# Altium project 16-07349-R5_SAM_L10_XPro.PrjPcb (part 1 of 3)
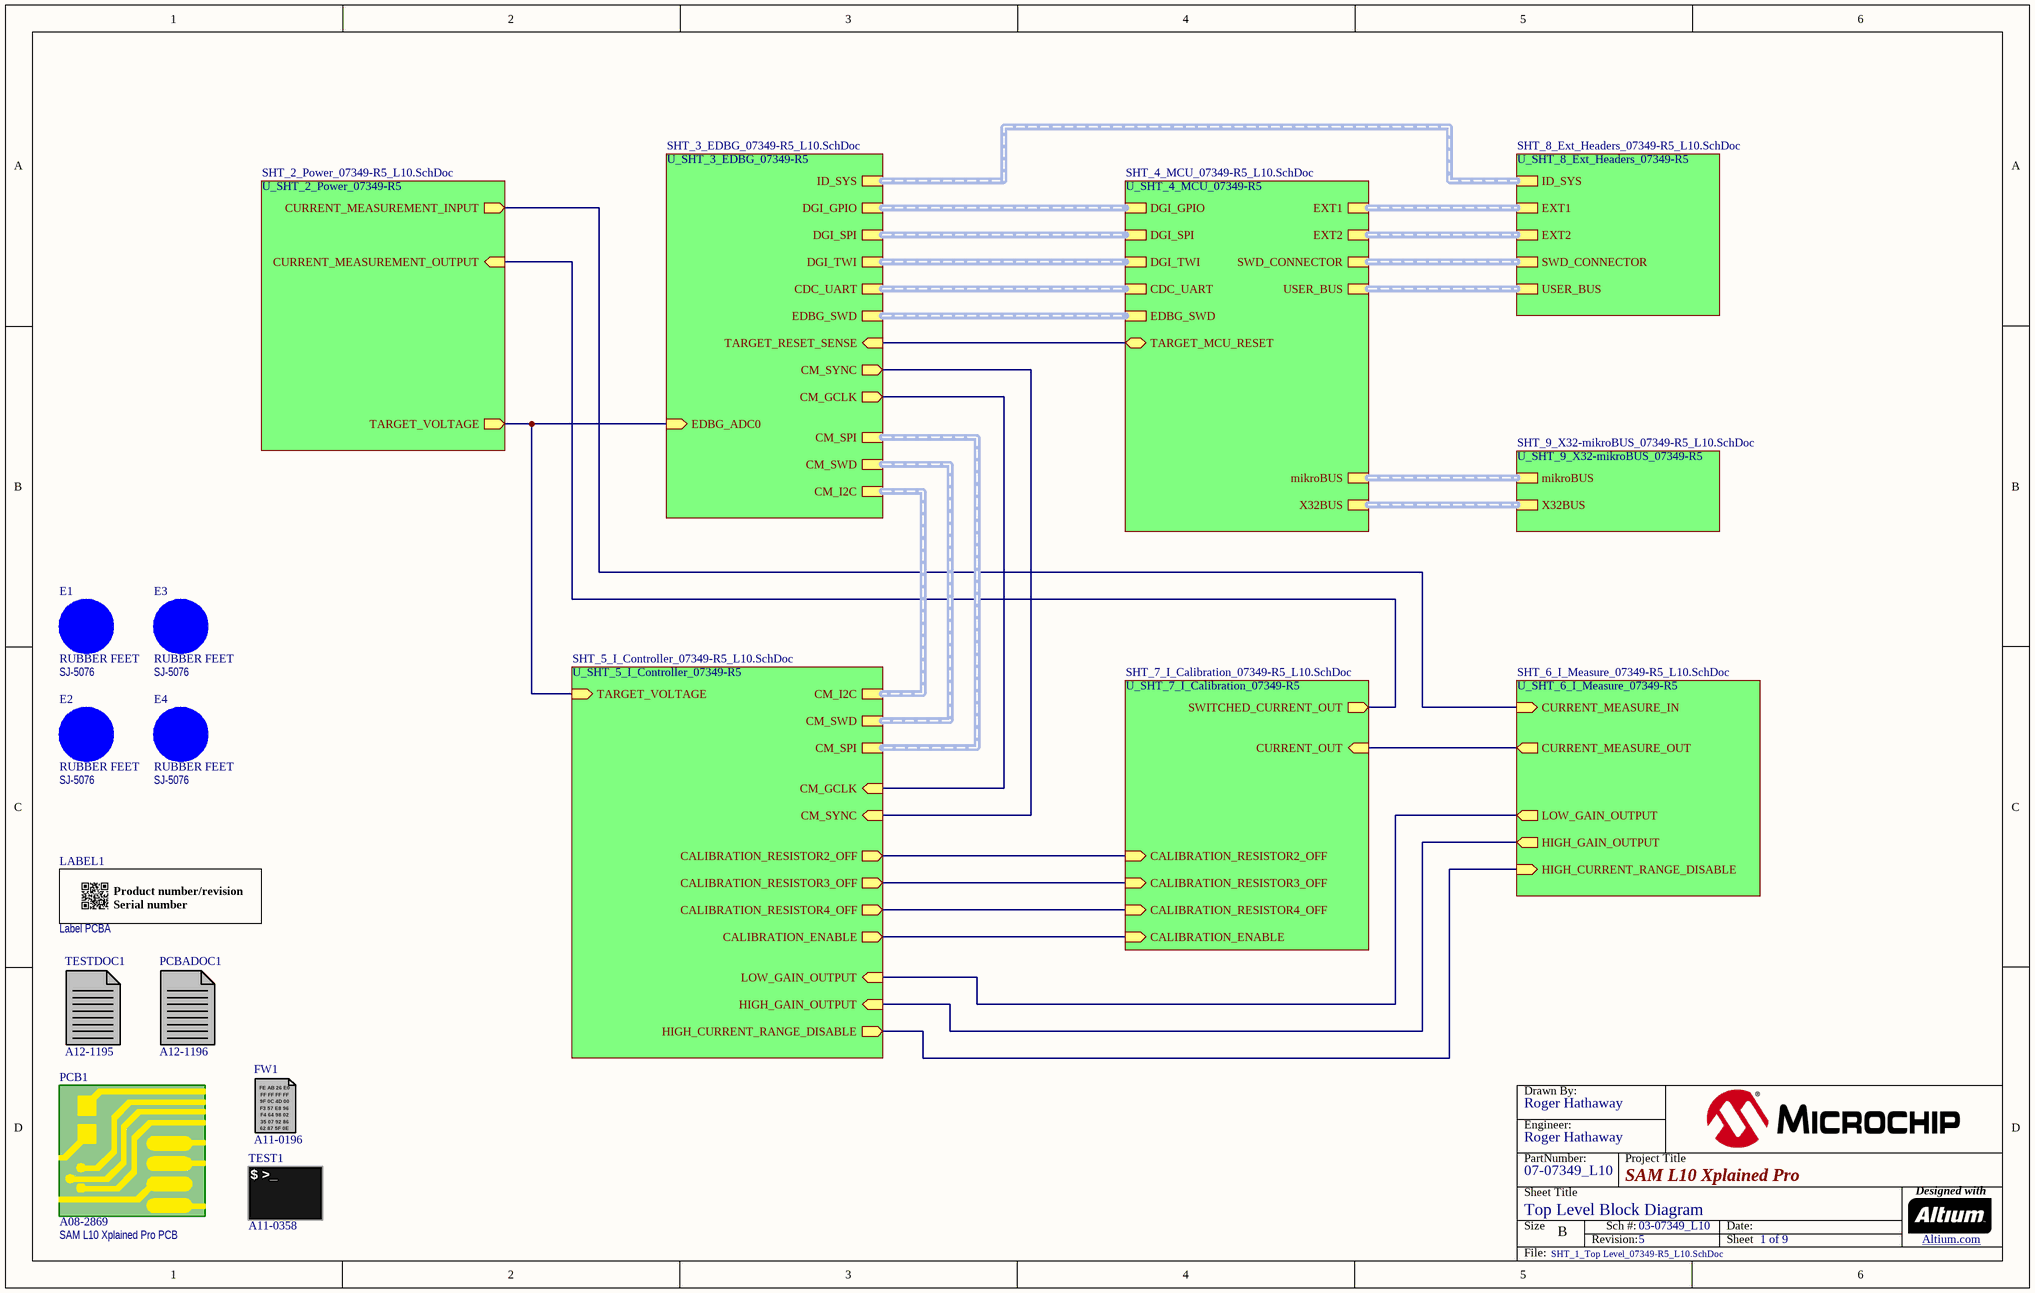
[diagram p0: SHT_1_Top Level_07349-R5_L10.SchDoc]
ProjectBoardNumber: 07349_L10; ProjectDrawnBy: Roger Hathaway; ProjectEngineer: Roger Hathaway; ProjectPartNumber: 07-07349_L10; ProjectRevisionART: 5; ProjectRevisionASSY: 5; ProjectRevisionFAB: 5; ProjectRevisionSCH: 5; ProjectTitle: SAM L10 Xplained Pro
9 sheets, 240 parts. Net scope: hierarchical (ports join the sheet entries above them; power ports are global).
Board file: 04-07349-R5_L10.PcbDoc
Sheets:
  SHT_1_Top Level_07349-R5_L10.SchDoc
    U_SHT_7_I_Calibration_07349-R5 = SHT_7_I_Calibration_07349-R5_L10.SchDoc
    U_SHT_6_I_Measure_07349-R5 = SHT_6_I_Measure_07349-R5_L10.SchDoc
    U_SHT_9_X32-mikroBUS_07349-R5 = SHT_9_X32-mikroBUS_07349-R5_L10.SchDoc
    U_SHT_8_Ext_Headers_07349-R5 = SHT_8_Ext_Headers_07349-R5_L10.SchDoc
    U_SHT_4_MCU_07349-R5 = SHT_4_MCU_07349-R5_L10.SchDoc
    U_SHT_3_EDBG_07349-R5 = SHT_3_EDBG_07349-R5_L10.SchDoc
    U_SHT_2_Power_07349-R5 = SHT_2_Power_07349-R5_L10.SchDoc
    U_SHT_5_I_Controller_07349-R5 = SHT_5_I_Controller_07349-R5_L10.SchDoc

## Sheet SHT_1_Top Level_07349-R5_L10.SchDoc
size B; CompanyName: Microchip Technology Inc.; Organization: Microchip Technology; Address1: 2355 West Chandler Blvd.; Address2: Chandler, AZ  85224; Address4: USA; SheetNumber: 1; SheetTotal: 9; SheetTitle: Top Level Block Diagram; Time: Time

### Parts
(Parts that share a designator on the sheet are numbered #1, #2 ... from top to bottom, then left to right.)
?#1  (no value)  (graphical)
E1  RUBBER FEET  value SJ-5076  [AP8-00192]
E2  RUBBER FEET  value SJ-5076  [AP8-00192]
E3  RUBBER FEET  value SJ-5076  [AP8-00192]
E4  RUBBER FEET  value SJ-5076  [AP8-00192]
FW1  AN: A11-0196  (hidden comment: FW)  (mechanical)
LABEL1  value Label PCBA  [AP8-00317]  (hidden comment: PCBA_LABEL)
PCB1  value SAM L10 Xplained Pro PCB  AN: A08-2869  (hidden comment: PCB)  (mechanical)
PCBADOC1  AN: A12-1196  (hidden comment: PCBADOC)  (mechanical)
TEST1  AN: A11-0358  (hidden comment: TEST)  (mechanical)
TESTDOC1  AN: A12-1195  (hidden comment: TESTDOC)  (mechanical)

### Sub-sheets
U_SHT_2_Power_07349-R5 = SHT_2_Power_07349-R5_L10.SchDoc: TARGET_VOLTAGE (out), CURRENT_MEASUREMENT_INPUT (out), CURRENT_MEASUREMENT_OUTPUT (in)
U_SHT_3_EDBG_07349-R5 = SHT_3_EDBG_07349-R5_L10.SchDoc: CDC_UART (harness CDC_UART), DGI_TWI (harness DGI_TWI), DGI_SPI (harness DGI_SPI), DGI_GPIO (harness DGI_GPIO), ID_SYS (harness ID_SYS), EDBG_ADC0 (in), CM_I2C (harness CM_I2C), CM_GCLK (out), CM_SYNC (out), CM_SWD (harness CM_SWD), CM_SPI (harness CM_SPI), EDBG_SWD (harness EDBG_SWD), TARGET_RESET_SENSE (in)
U_SHT_4_MCU_07349-R5 = SHT_4_MCU_07349-R5_L10.SchDoc: DGI_GPIO (harness DGI_GPIO), DGI_SPI (harness DGI_SPI), DGI_TWI (harness DGI_TWI), CDC_UART (harness CDC_UART), EXT2 (harness EXT), EXT1 (harness EXT), SWD_CONNECTOR (harness SWD), TARGET_MCU_RESET (bidir), EDBG_SWD (harness EDBG_SWD), mikroBUS (harness mikroBUS), X32BUS (harness X32BUS), USER_BUS (harness USER_BUS)
U_SHT_5_I_Controller_07349-R5 = SHT_5_I_Controller_07349-R5_L10.SchDoc: LOW_GAIN_OUTPUT (in), HIGH_GAIN_OUTPUT (in), HIGH_CURRENT_RANGE_DISABLE (out), CM_SPI (harness CM_SPI), CALIBRATION_RESISTOR4_OFF (out), CALIBRATION_RESISTOR2_OFF (out), CALIBRATION_RESISTOR3_OFF (out), CALIBRATION_ENABLE (out), CM_I2C (harness CM_I2C), CM_GCLK (in), CM_SYNC (in), TARGET_VOLTAGE (in), CM_SWD (harness CM_SWD)
U_SHT_6_I_Measure_07349-R5 = SHT_6_I_Measure_07349-R5_L10.SchDoc: LOW_GAIN_OUTPUT (out), HIGH_GAIN_OUTPUT (out), HIGH_CURRENT_RANGE_DISABLE (in), CURRENT_MEASURE_OUT (out), CURRENT_MEASURE_IN (in)
U_SHT_7_I_Calibration_07349-R5 = SHT_7_I_Calibration_07349-R5_L10.SchDoc: CALIBRATION_RESISTOR3_OFF (in), CALIBRATION_RESISTOR4_OFF (in), CALIBRATION_RESISTOR2_OFF (in), SWITCHED_CURRENT_OUT (out), CURRENT_OUT (in), CALIBRATION_ENABLE (in)
U_SHT_8_Ext_Headers_07349-R5 = SHT_8_Ext_Headers_07349-R5_L10.SchDoc: ID_SYS (harness ID_SYS), EXT1 (harness EXT), EXT2 (harness EXT), SWD_CONNECTOR (harness SWD), USER_BUS (harness USER_BUS)
U_SHT_9_X32-mikroBUS_07349-R5 = SHT_9_X32-mikroBUS_07349-R5_L10.SchDoc: mikroBUS (harness mikroBUS), X32BUS (harness X32BUS)

### Nets
CM_PA00_GPIO: sheet U_SHT_7_I_Calibration_07349-R5/CALIBRATION_RESISTOR3_OFF, sheet U_SHT_5_I_Controller_07349-R5/CALIBRATION_RESISTOR3_OFF
CM_PA01_GPIO: sheet U_SHT_7_I_Calibration_07349-R5/CALIBRATION_RESISTOR4_OFF, sheet U_SHT_5_I_Controller_07349-R5/CALIBRATION_RESISTOR4_OFF
CM_PA05_AIN5: sheet U_SHT_6_I_Measure_07349-R5/LOW_GAIN_OUTPUT, sheet U_SHT_5_I_Controller_07349-R5/LOW_GAIN_OUTPUT
CM_PA08_AIN16: sheet U_SHT_6_I_Measure_07349-R5/HIGH_GAIN_OUTPUT, sheet U_SHT_5_I_Controller_07349-R5/HIGH_GAIN_OUTPUT
CM_PA09_AIN17: sheet U_SHT_3_EDBG_07349-R5/EDBG_ADC0, sheet U_SHT_2_Power_07349-R5/TARGET_VOLTAGE, sheet U_SHT_5_I_Controller_07349-R5/TARGET_VOLTAGE
CM_PA10_GPIO: sheet U_SHT_7_I_Calibration_07349-R5/CALIBRATION_ENABLE, sheet U_SHT_5_I_Controller_07349-R5/CALIBRATION_ENABLE
CM_PA11_GCLK5: sheet U_SHT_3_EDBG_07349-R5/CM_SYNC, sheet U_SHT_5_I_Controller_07349-R5/CM_SYNC
CM_PA14_GCLK0: sheet U_SHT_3_EDBG_07349-R5/CM_GCLK, sheet U_SHT_5_I_Controller_07349-R5/CM_GCLK
CM_PA15_GPIO: sheet U_SHT_7_I_Calibration_07349-R5/CALIBRATION_RESISTOR2_OFF, sheet U_SHT_5_I_Controller_07349-R5/CALIBRATION_RESISTOR2_OFF
CM_PA18_CMP0: sheet U_SHT_6_I_Measure_07349-R5/HIGH_CURRENT_RANGE_DISABLE, sheet U_SHT_5_I_Controller_07349-R5/HIGH_CURRENT_RANGE_DISABLE
CURRENT_MEASURE_OUT: sheet U_SHT_7_I_Calibration_07349-R5/CURRENT_OUT, sheet U_SHT_6_I_Measure_07349-R5/CURRENT_MEASURE_OUT
CURRENT_MEASUREMENT_OUTPUT: sheet U_SHT_7_I_Calibration_07349-R5/SWITCHED_CURRENT_OUT, sheet U_SHT_2_Power_07349-R5/CURRENT_MEASUREMENT_OUTPUT
TARGET_MCU_RESET: sheet U_SHT_4_MCU_07349-R5/TARGET_MCU_RESET, sheet U_SHT_3_EDBG_07349-R5/TARGET_RESET_SENSE
VCC_CM_IN_P3V3: sheet U_SHT_6_I_Measure_07349-R5/CURRENT_MEASURE_IN, sheet U_SHT_2_Power_07349-R5/CURRENT_MEASUREMENT_INPUT

Not connected (* = marked no-connect by the designer): E1 1(FIDUCIAL); E2 1(FIDUCIAL); E3 1(FIDUCIAL); E4 1(FIDUCIAL)

### Buses and harness runs
harness sheet U_SHT_3_EDBG_07349-R5/CDC_UART = sheet U_SHT_4_MCU_07349-R5/CDC_UART
harness sheet U_SHT_3_EDBG_07349-R5/CM_I2C = sheet U_SHT_5_I_Controller_07349-R5/CM_I2C
harness sheet U_SHT_3_EDBG_07349-R5/CM_SPI = sheet U_SHT_5_I_Controller_07349-R5/CM_SPI
harness sheet U_SHT_3_EDBG_07349-R5/CM_SWD = sheet U_SHT_5_I_Controller_07349-R5/CM_SWD
harness sheet U_SHT_3_EDBG_07349-R5/DGI_GPIO = sheet U_SHT_4_MCU_07349-R5/DGI_GPIO
harness sheet U_SHT_3_EDBG_07349-R5/DGI_SPI = sheet U_SHT_4_MCU_07349-R5/DGI_SPI
harness sheet U_SHT_3_EDBG_07349-R5/DGI_TWI = sheet U_SHT_4_MCU_07349-R5/DGI_TWI
harness sheet U_SHT_3_EDBG_07349-R5/EDBG_SWD = sheet U_SHT_4_MCU_07349-R5/EDBG_SWD
harness sheet U_SHT_3_EDBG_07349-R5/ID_SYS = sheet U_SHT_8_Ext_Headers_07349-R5/ID_SYS
harness sheet U_SHT_4_MCU_07349-R5/EXT1 = sheet U_SHT_8_Ext_Headers_07349-R5/EXT1
harness sheet U_SHT_4_MCU_07349-R5/EXT2 = sheet U_SHT_8_Ext_Headers_07349-R5/EXT2
harness sheet U_SHT_4_MCU_07349-R5/mikroBUS = sheet U_SHT_9_X32-mikroBUS_07349-R5/mikroBUS
harness sheet U_SHT_4_MCU_07349-R5/SWD_CONNECTOR = sheet U_SHT_8_Ext_Headers_07349-R5/SWD_CONNECTOR
harness sheet U_SHT_4_MCU_07349-R5/USER_BUS = sheet U_SHT_8_Ext_Headers_07349-R5/USER_BUS
harness sheet U_SHT_4_MCU_07349-R5/X32BUS = sheet U_SHT_9_X32-mikroBUS_07349-R5/X32BUS

### Notes on the sheet
- Drawn By:
- Engineer:
- PartNumber:
- Project Title
- Sheet Title
- Size
- B
- Revision:
- Sch #:
- Date:
- Sheet
- Designed with
- Altium.com <http://go.altium.com/MicrochipLandingPage_Evaluation.html>
- File:
- (in symbol A09-0611) / Product number/revision / Serial number
- (in symbol A11-0196) FE AB 26 E0; FF FF FF FF; 9F 0C 4D 00; F3 57 E8 96; F4 64 98 02; 35 07 92 86; 62 87 5F 0E
- (in symbol A11-0358) $ >_

### Library data of the parts
?#1 = Title Block B
E1-E4 = A08-0053: 2.8mm adhesive feet,diam 8.0mm; PartGroup: Mechanical devices,Mounting accessories; Manufacturer: 3M; ComponentStatus: 'Active (verified)'; Verified date: 2006-05-05; Verified by: Ketil Skjerve; Status: Active; AN: A08-0053; Height: 2.79999995231628; MPN: SJ-5076; FootprintStatus: 'Active (Verified)'
FW1 = A11-0196: EDBG secured firmware; PartGroup: Software,Firmware,Tools; Manufacturer: ATMEL; ComponentStatus: 'Active (verified)'; Value: EDBG secured firmware
LABEL1 = A09-0611: PCBA identification label PP Top White Gloss; PartGroup: Mechanical devices,Packaging materials,Printed Labels; Manufacturer: ACT Logimark AS; MPN: 505462; ComponentStatus: 'Active (verified)'; Status: New; AN: A09-0611; FootprintStatus: 'Active (Verified)'
PCB1 = A08-2869: SAM L10 Xplained Pro PCB, 4 layer, 60mm x 100mm; PartGroup: Mechanical devices,Printed circuit boards; ComponentStatus: 'Active (verified)'
PCBADOC1 = A12-1196: SAM L10 Xplained Pro PCBA documentation; PartGroup: Documentation,PCBA Documents,Atmel; Value: A09-2769 PCBA Files; ComponentStatus: 'Active (verified)'
TEST1 = A11-0358: Fixture test for SAM L10 Xplained Pro; PartGroup: Software,Test software,Starter Kit; Value: SAM L10 Xplained Pro test; ComponentStatus: 'Active (verified)'
TESTDOC1 = A12-1195: SAM L10 Xplained Pro Test Instructions; PartGroup: Documentation,Procedures,Test Instructions; ComponentStatus: 'Active (verified)'; Value: SAM L10 Xplained Pro Test Instructions

## Sheet SHT_7_I_Calibration_07349-R5_L10.SchDoc
size B; CompanyName: Microchip Technology Inc.; Organization: Microchip Technology; Address1: 2355 West Chandler Blvd.; Address2: Chandler, AZ  85224; Address4: USA; SheetNumber: 6; SheetTotal: 9; SheetTitle: Current Measurement Calibration; Time: Time
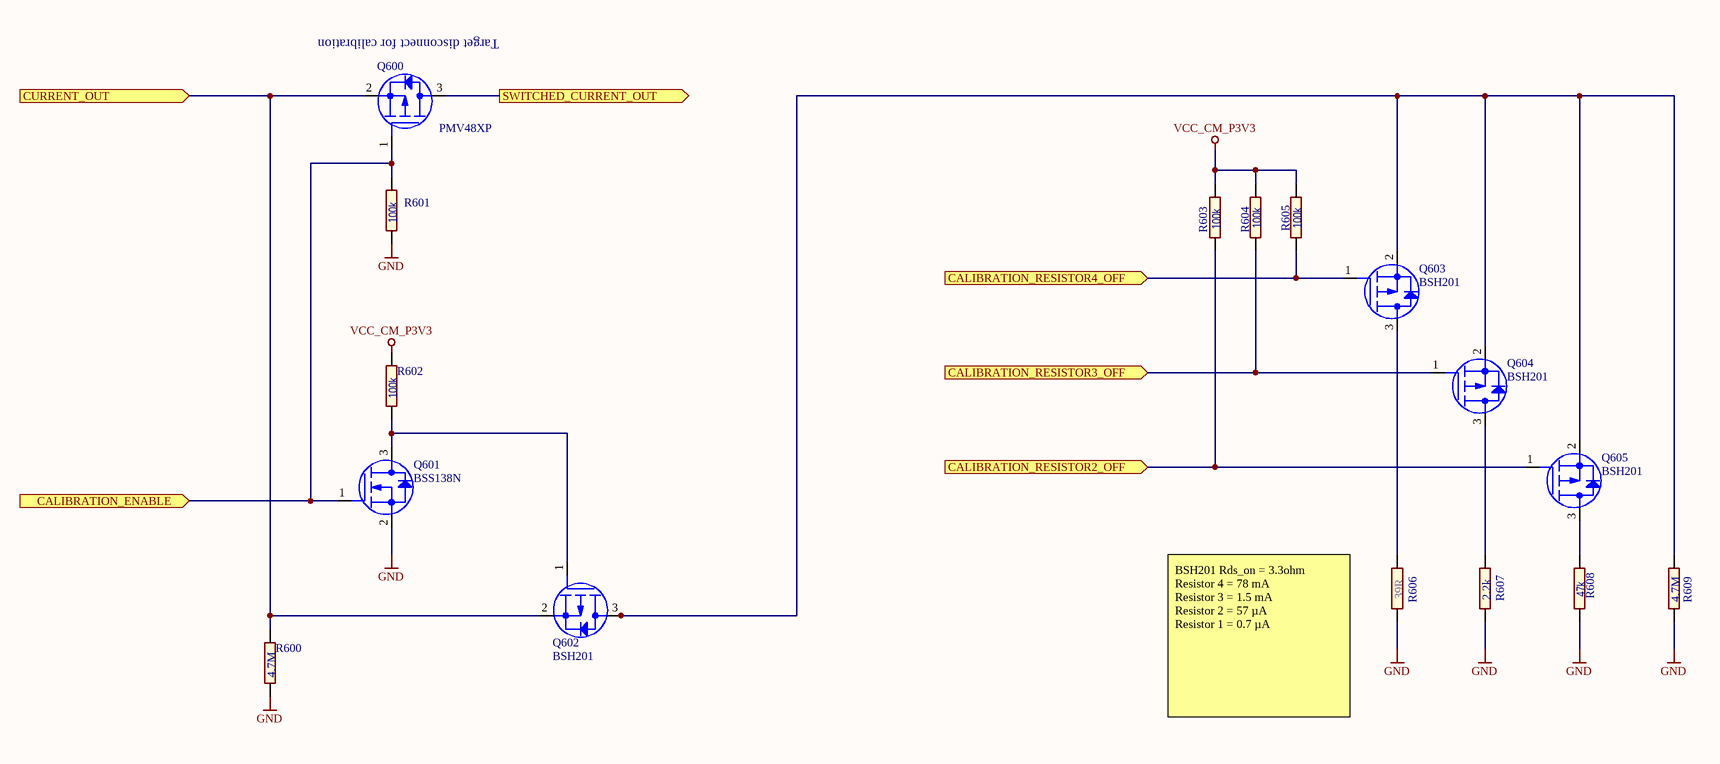
[diagram p1: SHT_7_I_Calibration_07349-R5_L10.SchDoc]

### Parts
(Parts that share a designator on the sheet are numbered #1, #2 ... from top to bottom, then left to right.)
?#2  (no value)  (graphical)
Q600  value PMV48XP  [AP5-00002]
Q601  value BSS138N  [AP5-00002]
Q602  value BSH201  [AP5-00002]
Q603  value BSH201  [AP5-00002]
Q604  value BSH201  [AP5-00002]
Q605  value BSH201  [AP5-00002]
R600  value 4.7M  [AP2-00011]
R601  value 100k  [AP2-00011]
R602  value 100k  [AP2-00011]
R603  value 100k  [AP2-00011]
R604  value 100k  [AP2-00011]
R605  value 100k  [AP2-00011]
R606  value 39R  [AP2-00011]
R607  value 2.2k  [AP2-00011]
R608  value 47k  [AP2-00011]
R609  value 4.7M  [AP2-00011]

### Ports
CALIBRATION_ENABLE (in), CALIBRATION_RESISTOR2_OFF (in), CALIBRATION_RESISTOR3_OFF (in), CALIBRATION_RESISTOR4_OFF (in), CURRENT_OUT (in), SWITCHED_CURRENT_OUT (out)

### Nets
GND: Q601.2(S) R600.1 R601.1 R606.1 R607.1 R608.1 R609.1
VCC_CM_P3V3: R602.2 R603.2 R604.2 R605.2
CM_PA00_GPIO: Q604.1(G) R604.1 ; port CALIBRATION_RESISTOR3_OFF
CM_PA01_GPIO: Q603.1(G) R605.1 ; port CALIBRATION_RESISTOR4_OFF
CM_PA10_GPIO: Q600.1(G) Q601.1(G) R601.2 ; port CALIBRATION_ENABLE
CM_PA15_GPIO: Q605.1(G) R603.1 ; port CALIBRATION_RESISTOR2_OFF
CURRENT_MEASURE_OUT: Q600.2(S) Q602.2(S) R600.2 ; port CURRENT_OUT
CURRENT_MEASUREMENT_OUTPUT: Q600.3(D) ; port SWITCHED_CURRENT_OUT
NetQ601_3: Q601.3(D) Q602.1(G) R602.1
NetQ602_3: Q602.3(D) Q603.2(S) Q604.2(S) Q605.2(S) R609.2
NetQ603_3: Q603.3(D) R606.2
NetQ604_3: Q604.3(D) R607.2
NetQ605_3: Q605.3(D) R608.2

### Notes on the sheet
- (near Q600) Target disconnect for calibration
- (near R606) BSH201 Rds_on = 3.3ohm
  Resistor 4 = 78 mA
  Resistor 3 = 1.5 mA
  Resistor 2 = 57 µA
  Resistor 1 = 0.7 µA
- Drawn By:
- Engineer:
- PartNumber:
- Project Title
- Sheet Title
- Size
- B
- Revision:
- Sch #:
- Date:
- Sheet
- Designed with
- Altium.com <http://go.altium.com/MicrochipLandingPage_Evaluation.html>
- File:

### Library data of the parts
?#2 = Title Block B
Q600 = A05-0130: P-Channel Digital FET. -30V, -3.5A continuous, -14A Peak. RDS(ON)=48mOhm@VGS=-4.5V, RDS(ON)=71mOhm@VGS=-2.5V. VGS(th)<1.25V; PartGroup: Transistors,Power FET,SMD; Manufacturer: NXP; MPN: PMV48XP,215; TemperatureRange: -55Â°C to +150Â°C; ComponentStatus: 'Active (verified)'; Status: New; AN: A05-0130; FootprintStatus: 'Active (Verified)'
Q601 = A05-0140: Low leakage N-Channel MOSFET. 60V, 0.23A continuous, 0.92A Peak. RDS(ON) = 3.5Ohm@VGS=4.5V, VGS(th)<1.4V; PartGroup: Transistors,Small signal FET,SMD; Manufacturer: Infineon; TemperatureRange: -55  to +150 deg celcius; ComponentStatus: 'Active (verified)'; Status: New; AN: A05-0140; Height: 1.10000002384186; MPN: BSS138N; FootprintStatus: 'Active (Verified)'
Q602-Q605 = A05-0132: P-Channel Digital FET. -60V, -0.3A continuous, -1.2A Peak. RDS(ON)=2.5@VGS=-10V, RDS(ON)=<5 ohm @VGS=-2.5V. VGS(th)<1.9V; PartGroup: Transistors,Small signal FET,SMD; Manufacturer: NXP; MPN: BSH201,215; ComponentStatus: 'Active (verified)'; Status: New; AN: A05-0132; FootprintStatus: 'Active (Verified)'
R600 R609 = A02-0884: Thick film SMD 0402 1/16W 1%; PartGroup: Resistors,SMD,0402 1%; Manufacturer: YAGEO CORP; MPN: RC0402FR-074M7L; TemperatureRange: -55 Â°C to +155 Â°C; ComponentStatus: 'Active (verified)'; Status: Active; Verified by: Lars Helge Mo; Verified date: 2005-12-19; AN: A02-0884; Tolerance: 1 %; FootprintStatus: 'Active (Verified)'
R601-R605 = A02-0260: Thick film resistor, SMD 0402, 1/16W, 1%; PartGroup: Resistors,SMD,0402 1%; Manufacturer: ASJ; MPN: CR10-1003-FK; TemperatureRange: -55ï¿½ to +125ï¿½C; ComponentStatus: 'Active (verified)'; Status: Active; Verified by: Lars Helge Mo; Verified date: 2005-12-19; AN: A02-0260; Tolerance: 1 %; Height: 0.349999994039536; FootprintStatus: 'Active (Verified)'
R606 = A02-0178: Thick film resistor, SMD 0402, 1/16W, 1%; PartGroup: Resistors,SMD,0402 1%; MPN: CR10-39R0-FK; Manufacturer: ASJ; TemperatureRange: -55 - +125 deg C; ComponentStatus: 'Active (verified)'; Status: Active; Verified by: Lars Helge Mo; Verified date: 2005-12-19; AN: A02-0178; Tolerance: 1 %; Height: 0.349999994039536; FootprintStatus: 'Active (Verified)'
R607 = A02-0220: Thick film resistor, SMD 0402, 1/16W, 1%; PartGroup: Resistors,SMD,0402 1%; Manufacturer: YAGEO CORP; MPN: RC0402FR-072K2L; TemperatureRange: -55 - +125 deg C; ComponentStatus: 'Active (verified)'; Status: Active; Verified by: Lars Helge Mo; Verified date: 2005-12-19; AN: A02-0220; Tolerance: 1 %; Height: 0.349999994039536; FootprintStatus: 'Active (Verified)'
R608 = A02-0252: Thick film resistor, SMD 0402, 1/16W, 1%; PartGroup: Resistors,SMD,0402 1%; Manufacturer: KOA; MPN: RK73H1ETTP4702F; TemperatureRange: -55 - +125 deg C; ComponentStatus: 'Active (verified)'; Status: Active; Verified by: Lars Helge Mo; Verified date: 2005-12-19; AN: A02-0252; Tolerance: 1 %; Height: 0.349999994039536; FootprintStatus: 'Active (Verified)'

## Sheet SHT_6_I_Measure_07349-R5_L10.SchDoc
size B; CompanyName: Microchip Technology Inc.; Organization: Microchip Technology; Address1: 2355 West Chandler Blvd.; Address2: Chandler, AZ  85224; Address4: USA; SheetNumber: 7; SheetTotal: 9; SheetTitle: Current Measurement Front End; Time: Time
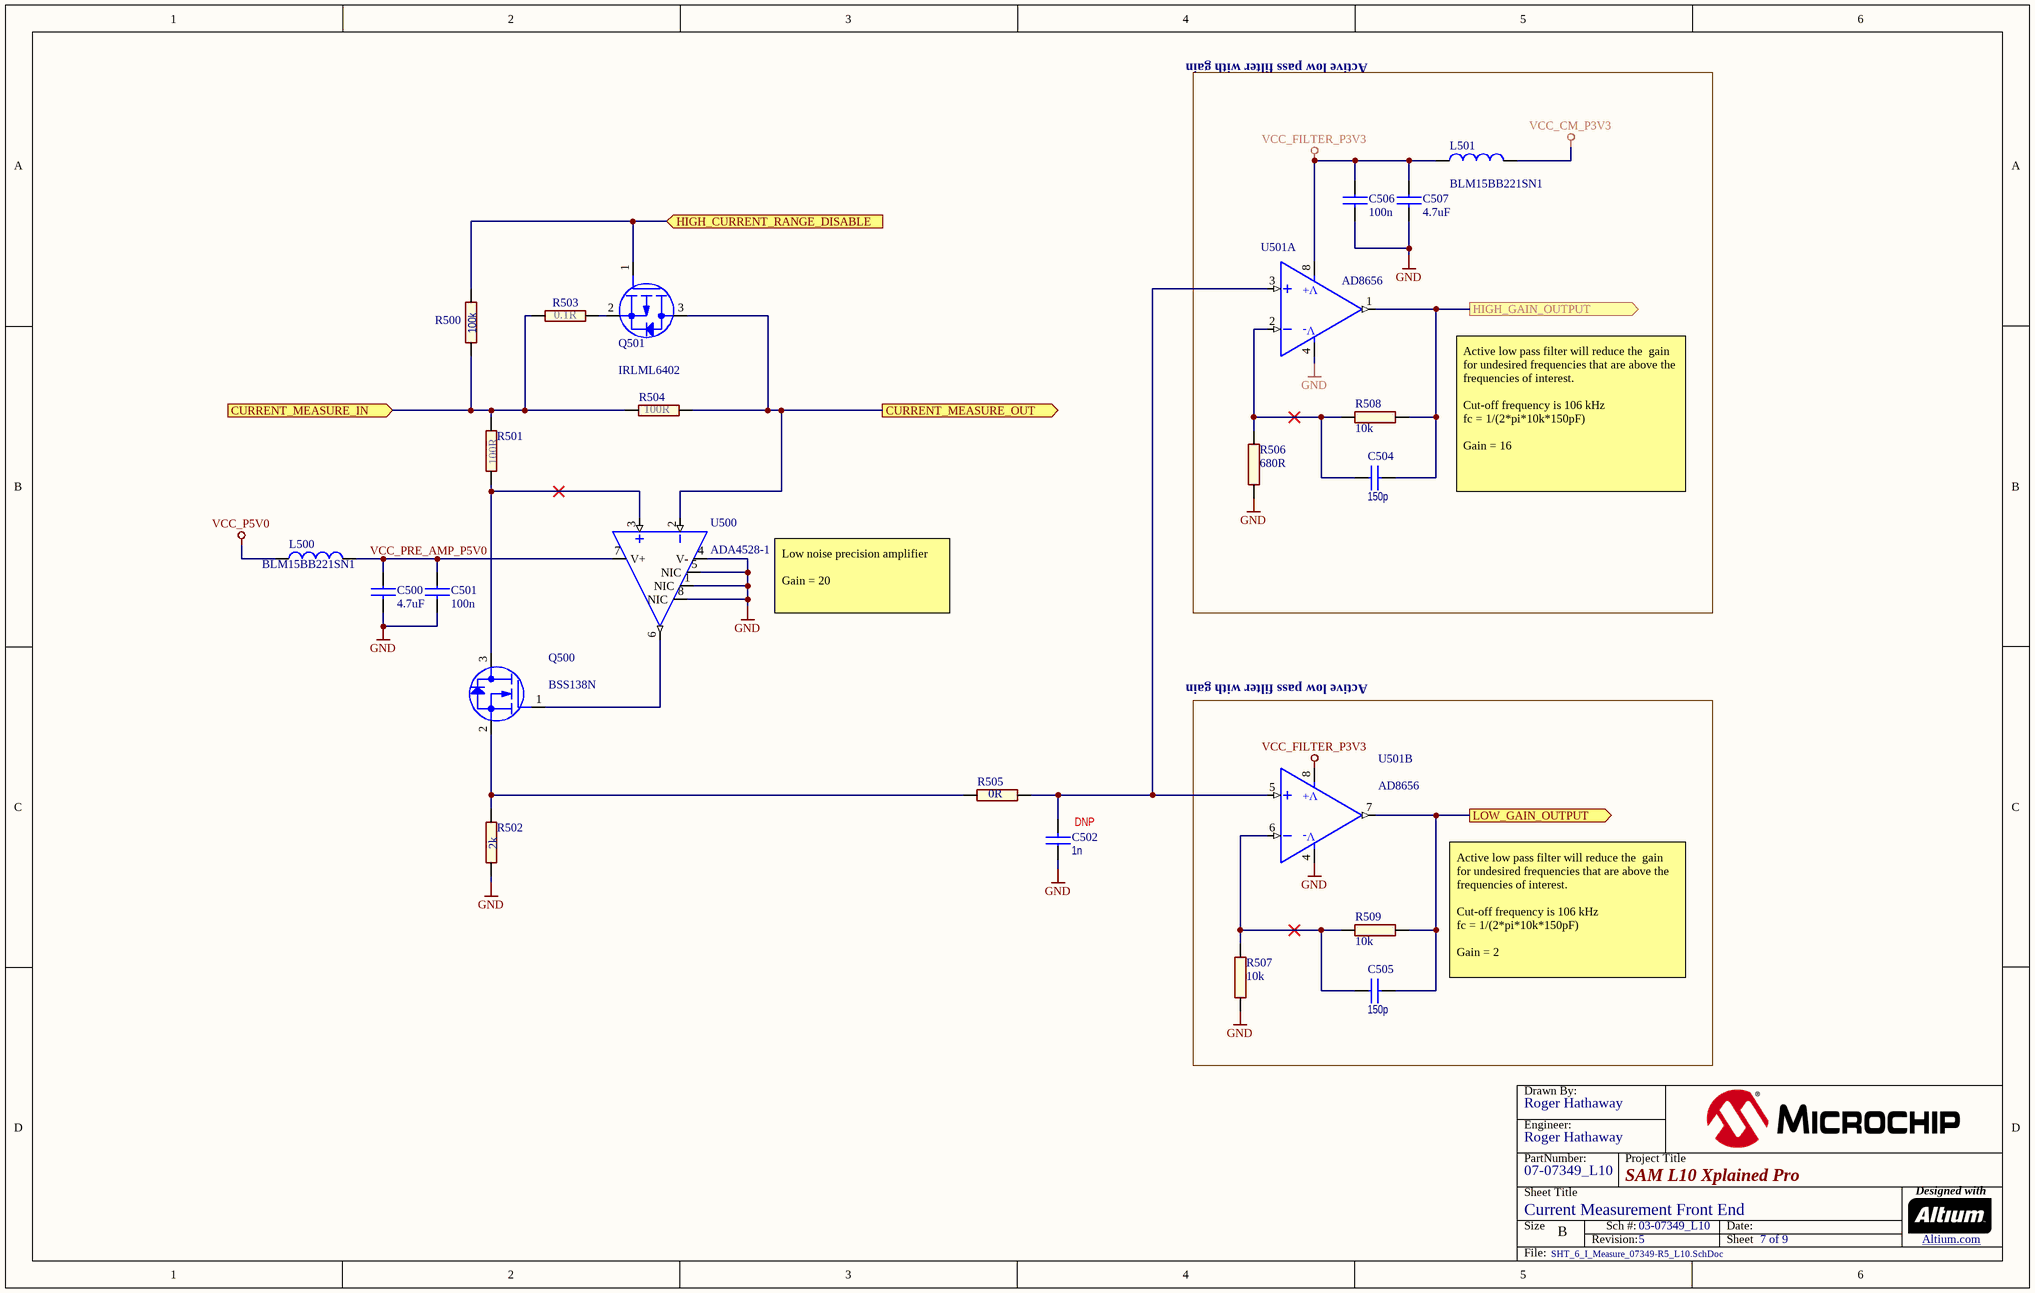
[diagram p2: SHT_6_I_Measure_07349-R5_L10.SchDoc]

### Parts
(Parts that share a designator on the sheet are numbered #1, #2 ... from top to bottom, then left to right.)
?#3  (no value)  (graphical)
C500  value 4.7uF  [AP1-00117]
C501  value 100n  [AP1-00053]  (hidden comment: CAP-NONPOL)
C502  value 1n  Placement: DNP  [AP1-00053]
C504  value 150p  [AP1-00053]
C505  value 150p  [AP1-00053]
C506  value 100n  [AP1-00053]
C507  value 4.7uF  [AP1-00117]
L500  value BLM15BB221SN1  [AP3-00028]
L501  value BLM15BB221SN1  [AP3-00028]
Q500  value BSS138N  [AP5-00002]
Q501  value IRLML6402  [AP5-00002]
R500  value 100k  [AP2-00011]
R501  value 100R  [AP2-00076]
R502  value 2k  [AP2-00076]
R503  value 0.1R  [AP2-00076]
R504  value 100R  [AP2-00076]
R505  value 0R  [AP2-00011]
R506  value 680R  [AP2-00011]
R507  value 10k  [AP2-00011]
R508  value 10k  [AP2-00011]
R509  value 10k  [AP2-00011]
U500  value ADA4528-1  [AP6-00100]
U501  value AD8656  [AP6-00100]  (parts A,B of 2)

### Blocks framed on the sheet
Active low pass filter with gain: C504 C506 C507 L501 R506 R508 U501

### Ports
CURRENT_MEASURE_IN (in), CURRENT_MEASURE_OUT (out), HIGH_CURRENT_RANGE_DISABLE (in), HIGH_GAIN_OUTPUT (out), LOW_GAIN_OUTPUT (out)

### Nets
GND: C500.2 C501.2 C502.1 C506.2 C507.2 R502.1 R506.1 R507.1 U500.1(NIC) U500.4(V-) U500.5(NIC) U500.8(NIC) U501.4(V-)
VCC_CM_P3V3: L501.1
VCC_FILTER_P3V3: C506.1 C507.1 L501.2 U501.8(V+)
VCC_P5V0: L500.1
CM_PA05_AIN5: C505.2 R509.2 U501.7(OUTB) ; port LOW_GAIN_OUTPUT
CM_PA08_AIN16: C504.2 R508.2 U501.1(OUTA) ; port HIGH_GAIN_OUTPUT
CM_PA18_CMP0: Q501.1(G) R500.2 ; port HIGH_CURRENT_RANGE_DISABLE
CURRENT_MEASURE_OUT: Q501.3(D) R504.2 U500.2(IN-) ; port CURRENT_MEASURE_OUT
VCC_CM_IN_P3V3: R500.1 R501.2 R503.1 R504.1 ; port CURRENT_MEASURE_IN
VCC_PRE_AMP_P5V0: C500.1 C501.1 L500.2 U500.7(V+)
NetC502_2: C502.2 R505.1 U501.3(INA_+) U501.5(INB_+)
NetC504_1: C504.1 R506.2 R508.1 U501.2(INA_-)
NetC505_1: C505.1 R507.2 R509.1 U501.6(INB_-)
NetQ500_1: Q500.1(G) U500.6(OUT)
NetQ500_2: Q500.2(S) R502.2 R505.2
NetQ500_3: Q500.3(D) R501.1 U500.3(IN+)
NetQ501_2: Q501.2(S) R503.2

### Notes on the sheet
- Active low pass filter will reduce the  gain for undesired frequencies that are above the frequencies of interest.
  Cut-off frequency is 106 kHz
  fc = 1/(2*pi*10k*150pF)
  Gain = 16
- Low noise precision amplifier
  Gain = 20
- Active low pass filter with gain
- Active low pass filter will reduce the  gain for undesired frequencies that are above the frequencies of interest.
  Cut-off frequency is 106 kHz
  fc = 1/(2*pi*10k*150pF)
  Gain = 2
- Drawn By:
- Engineer:
- PartNumber:
- Project Title
- Sheet Title
- Size
- B
- Revision:
- Sch #:
- Date:
- Sheet
- Designed with
- Altium.com <http://go.altium.com/MicrochipLandingPage_Evaluation.html>
- File:

### Library data of the parts
?#3 = Title Block B
C500 C507 = A01-0377: Ceramic capacitor, SMD 0603, X5R, 10V, 10% (de31036); PartGroup: Capacitors,Ceramic,SMD 0603; Manufacturer: tdk; MPN: C1608X5R1A475K; TemperatureRange: -55 - +85 deg C; ComponentStatus: 'Active (verified)'; Status: Active; Verified by: Lars Helge Mo; Verified date: 2005-12-15; AN: A01-0377; Tolerance: 10%; Height: 0.800000011920929; FootprintStatus: 'Active (Verified)'
C501 C506 = A01-0246: Ceramic capacitor, SMD 0402, X7R, 16V, +/-10%; PartGroup: Capacitors,Ceramic,SMD 0402; Manufacturer: Kemet; MPN: C0402C104K4RACTU; TemperatureRange: -55 - +125 deg C; ComponentStatus: 'Active (verified)'; Status: Active; Verified by: Lars Helge Mo; Verified date: 2005-12-15; AN: A01-0246; Tolerance: 16V, +/-10%; Height: 0.5; FootprintStatus: 'Active (Verified)'
C502 = A01-0038: Ceramic capacitor, SMD 0402, X7R, 50V, +/-10%; PartGroup: Capacitors,Ceramic,SMD 0402; Manufacturer: YAGEO CORP; MPN: CC0402KRX7R9BB102; TemperatureRange: -55 - +125 deg C; ComponentStatus: 'Active (verified)'; Status: Active; Verified by: Lars Helge Mo; Verified date: 2005-12-15; AN: A01-0038; Tolerance: 50V, +/-10%; Height: 0.550000011920929; FootprintStatus: 'Active (Verified)'
C504 C505 = A01-0028: Ceramic capacitor, SMD 0402, X7R, 50V, +/-10%; PartGroup: Capacitors,Ceramic,SMD 0402; Manufacturer: YAGEO CORP; MPN: CC0402KRX7R9BB151; TemperatureRange: -55 - +125 deg C; ComponentStatus: 'Active (verified)'; Status: Active; Verified by: Lars Helge Mo; Verified date: 2005-12-15; AN: A01-0028; Tolerance: 50V, +/-10%; Height: 0.550000011920929; FootprintStatus: 'Active (Verified)'
L500 L501 = A03-0037: SMD RF inductor 0402. Z=220Ohm (@100MHz), Max R(dc)=0.80Ohm, Max current=200mA; PartGroup: Inductors,EMI; Manufacturer: Murata; Tolerance: ±25%; TemperatureRange: -55°C to +125°C; ComponentStatus: 'Active (verified)'; Verified date: 2006-01-30; Verified by: Lars Helge Mo; Status: Active; AN: A03-0037; Height: 0.5; MPN: BLM15BB221SN1; FootprintStatus: 'Active (Verified)'
Q500 = A05-0140: as Q601 on sheet SHT_7_I_Calibration_07349-R5_L10; Status: New; AN: A05-0140; Height: 1.10000002384186; MPN: BSS138N; FootprintStatus: 'Active (Verified)'
Q501 = A05-0087: P-ch. MOSFET. -30V, -3.7A continuous,RDS(ON)=0.05Ohm@VGS=-4,5V, RDS(ON)=0.08Ohm@VGS=-2.5V; PartGroup: Transistors,Power FET,SMD; Manufacturer: International Rectifier; MPN: IRLML6402PBF; TemperatureRange: -55 - +150 deg C; ComponentStatus: 'Active (verified)'; Status: New; AN: A05-0087; Height: 1.14999997615814; FootprintStatus: 'Active (Verified)'
R500 = A02-0260: as R601 on sheet SHT_7_I_Calibration_07349-R5_L10; Status: Active; Verified by: Lars Helge Mo; Verified date: 2005-12-19; AN: A02-0260; Tolerance: 1 %; Height: 0.349999994039536; FootprintStatus: 'Active (Verified)'
R501 R504 = A02-0895: ERA-3YEB101V, metal film, 100R Â±0.1%, resistor in 0603 at 100mW, TEMPCO Â±25ppm/Â°C, Max V=75V; PartGroup: Resistors,Metal film,SMD Precision resistors; Manufacturer: Panasonic; MPN: ERA3YEB101V; ComponentStatus: 'Active (verified)'; Status: Active; Verified by: Lars Helge Mo; Verified date: 2005-12-19; AN: A02-0895; Height: 0.550000011920929; FootprintStatus: 'Active (Verified)'
R502 = A02-0081: Thick film resistor, SMD 0603, 1/10W, 1%; PartGroup: Resistors,SMD,0603 1%; Manufacturer: YAGEO CORP; MPN: RC0603FR-072KL; ComponentStatus: 'Active (verified)'; Status: Active; Verified by: Lars Helge Mo; Verified date: 2005-12-19; AN: A02-0081; Tolerance: 1 %; Height: 0.5; FootprintStatus: 'Active (Verified)'
R503 = A02-0896: WSL0603R1000FEA, metal strip resistor, 0.1 Ohm, +-1%, 0603 SMD, 1/10 W, TEMPCO +-75 ppm/Â°C; PartGroup: Resistors,Sense resistors,SMD Current Sense; Manufacturer: vishay; ComponentStatus: 'Active (verified)'; Status: Active; Verified by: Lars Helge Mo; Verified date: 2005-12-19; AN: A02-0896; Height: 0.330000013113022; MPN: WSL0603R1000FEA; FootprintStatus: 'Active (Verified)'
R505 = A02-0163: RES 0.0 OHM 1/16W 0402 SMD; PartGroup: Resistors,SMD,0402 1%; Manufacturer: (n/a); MPN: RMCF0402ZT0R00; Tolerance: 1 %; TemperatureRange: -55 - +125 deg C; ComponentStatus: 'Active (verified)'; Status: Active; Verified by: Lars Helge Mo; Verified date: 2005-12-19; AN: A02-0163; Height: 0.349999994039536; FootprintStatus: 'Active (Verified)'
R506 = A02-0208: Thick film resistor, SMD 0402, 1/16W, 1%; PartGroup: Resistors,SMD,0402 1%; Manufacturer: ASJ; MPN: CR10-6800-FK; TemperatureRange: -55 - +125 deg C; ComponentStatus: 'Active (verified)'; Status: Active; Verified by: Lars Helge Mo; Verified date: 2005-12-19; AN: A02-0208; Tolerance: 1 %; Height: 0.349999994039536; FootprintStatus: 'Active (Verified)'
R507-R509 = A02-0236: Thick film resistor, SMD 0402, 1/16W, 1%; PartGroup: Resistors,SMD,0402 1%; Manufacturer: Vishay; MPN: CRCW040210K0FKED; TemperatureRange: -55 - +125 deg C; ComponentStatus: 'Active (verified)'; Status: Active; Verified by: Lars Helge Mo; Verified date: 2005-12-19; AN: A02-0236; Tolerance: 1 %; Height: 0.349999994039536; FootprintStatus: 'Active (Verified)'
U500 = A06-1134: Precision OpAmp, Zero-Drift 0.015uV/K, ultra low noise 5.6nV/sqrt(Hz), Vo=2uV, GBW=4MHz, single supply 2.2V to 5.5V or dual supply +-1V to +-2.75V, rail to rail, unity gain stable; PartGroup: Integrated Circuits,General linear,OP-AMP; Manufacturer: Analog Devices; MPN: ADA4528-1ARMZ; ComponentStatus: 'Active (verified)'; Status: Active; Verified by: rmeslo; Verified date: 20.02.2006; AN: A06-1134; Height: 1.10000002384186; FootprintStatus: 'Active (Verified)'
U501 = A06-1125: AD8656, dual low noise precision OpAmp, rail-to-rail, low offset 250uV, GBP 28 MHz, 8MSOP; PartGroup: Integrated Circuits,General linear,OP-AMP; Manufacturer: Analog Devices; MPN: AD8656ARMZ; TemperatureRange: -40 to +125 deg celcius; ComponentStatus: 'Active (verified)'; Status: Active; Verified by: rmeslo; Verified date: 20.02.2006; AN: A06-1125; Height: 1.10000002384186; FootprintStatus: 'Active (Verified)'

## Sheet SHT_9_X32-mikroBUS_07349-R5_L10.SchDoc
size B; CompanyName: Microchip Technology Inc.; Organization: Microchip Technology; Address1: 2355 West Chandler Blvd.; Address2: Chandler, AZ  85224; Address4: USA; SheetNumber: 9; SheetTotal: 9; SheetTitle: X32 and mikroBUS Connectors; Time: Time
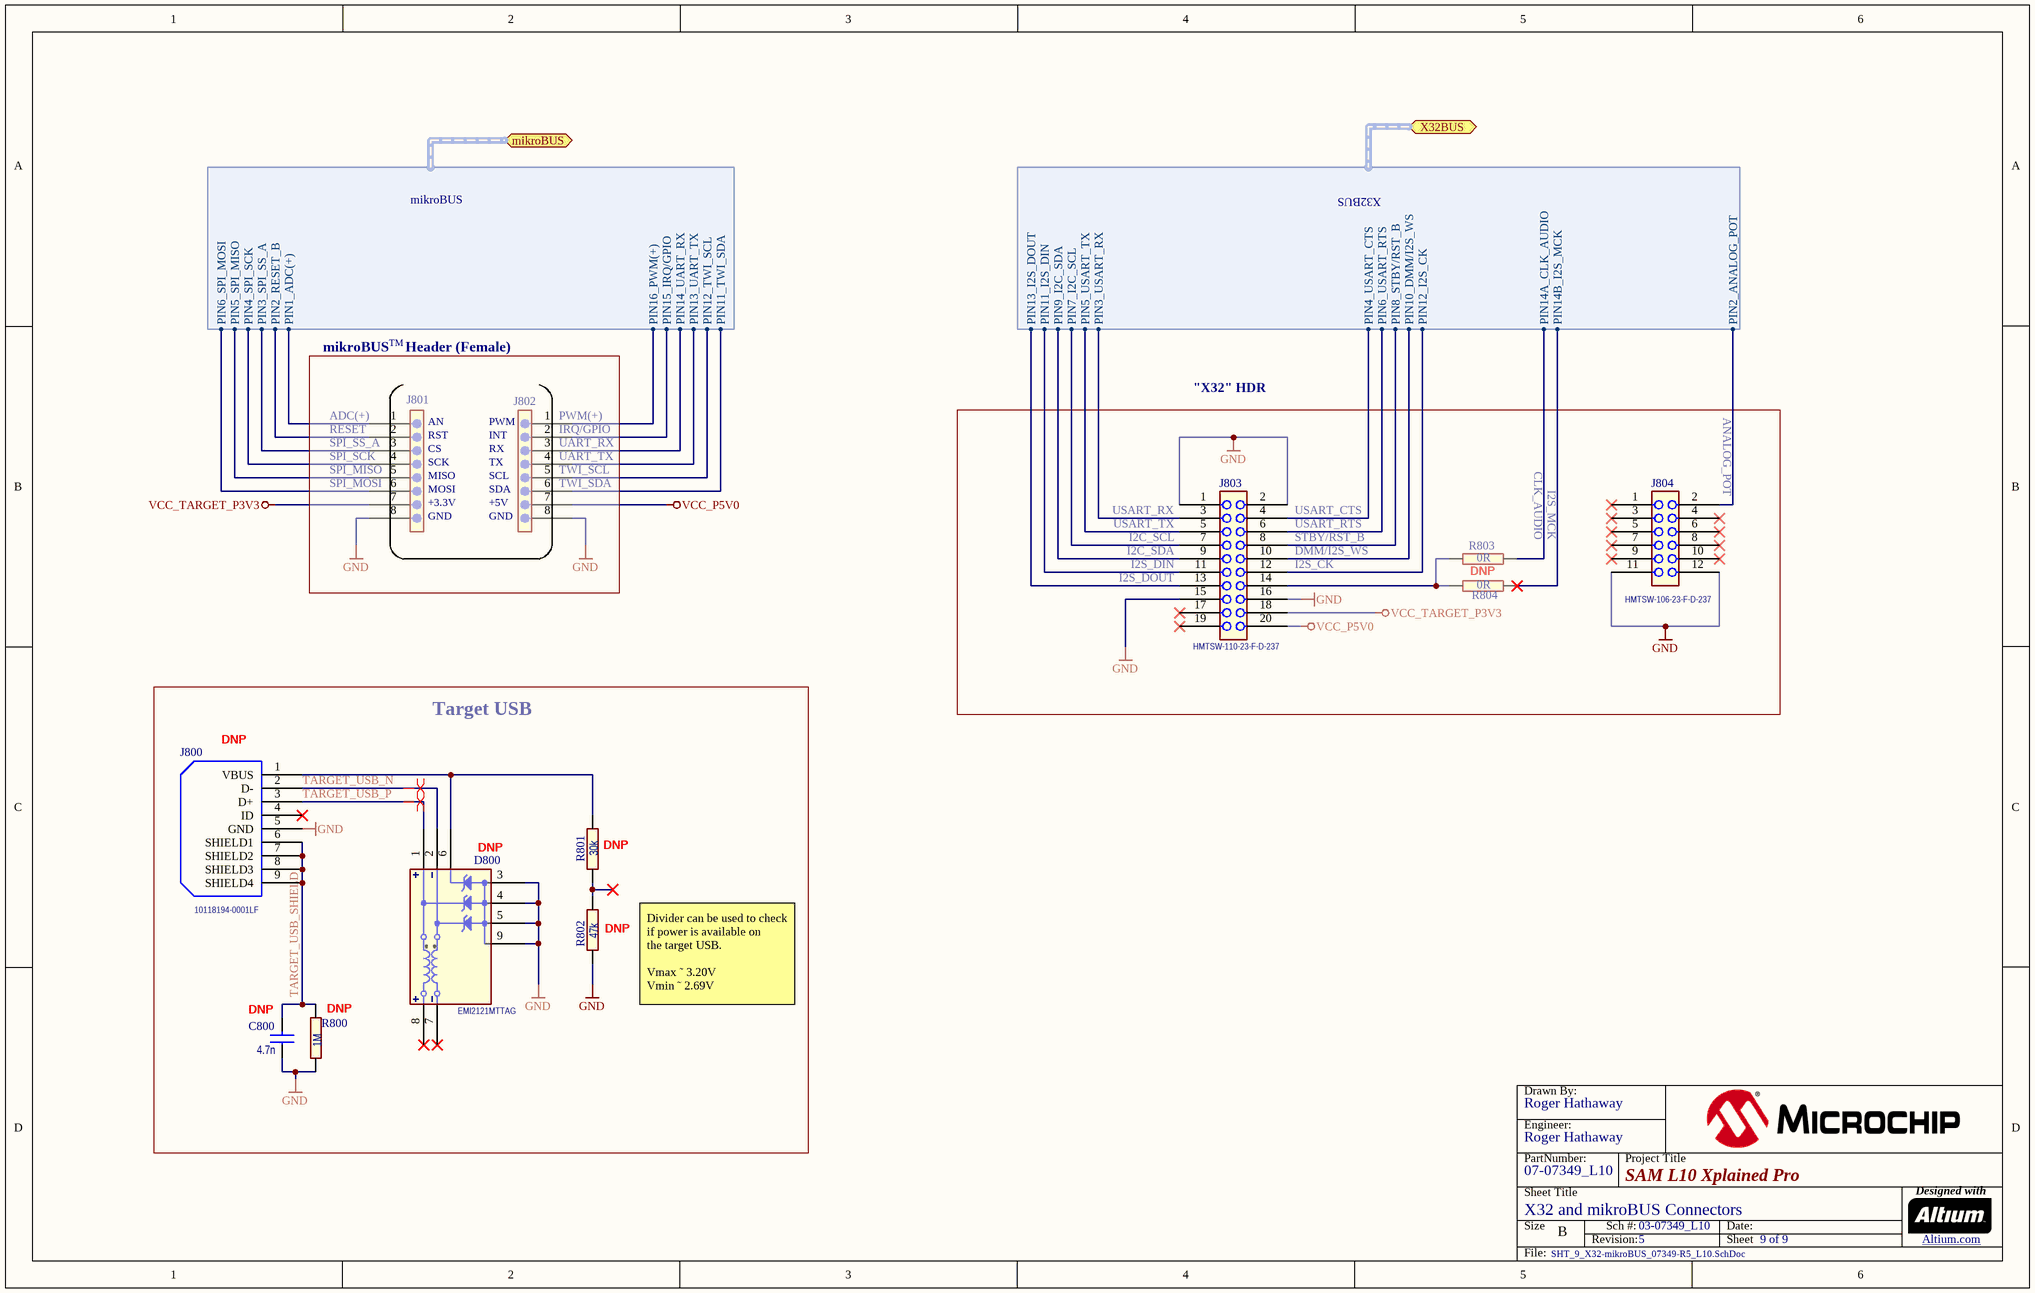
[diagram p3: SHT_9_X32-mikroBUS_07349-R5_L10.SchDoc]

### Parts
(Parts that share a designator on the sheet are numbered #1, #2 ... from top to bottom, then left to right.)
?#4  (no value)  (graphical)
C800  value 4.7n  Placement: DNP  [AP1-00053]
D800  value EMI2121MTTAG  Placement: DNP  [AP4-00159]  (hidden comment: WDFN8)
J800  MPN: 10118194-0001LF  Placement: DNP  [AP8-01117]  (hidden comment: USB_AB)
J801  HEADER 1x8 FEMALE  [AP8-00823]  (value not drawn)
J802  HEADER 1x8 FEMALE  [AP8-00823]  (value not drawn)
J803  value HMTSW-110-23-F-D-237  [AP8-00744]  (hidden comment: Same as A08-1514 but with 1mm hole)
J804  value HMTSW-106-23-F-D-237  [AP8-00809]  (hidden comment: HEADER 2x6)
R800  value 1M  Placement: DNP  [AP2-00011]
R801  value 30k  Placement: DNP  [AP2-00011]
R802  value 47k  Placement: DNP  [AP2-00011]
R803  value 0R  [AP2-00000]
R804  value 0R  Placement: DNP  [AP2-00000]

### Blocks framed on the sheet
"X32" HDR: J803 J804 R803 R804
Target USB: C800 D800 J800 R800-R802

### Ports
mikroBUS (harness mikroBUS), X32BUS (harness X32BUS)

### Harnesses
mikroBUS: PIN6_SPI_MOSI, PIN5_SPI_MISO, PIN4_SPI_SCK, PIN3_SPI_SS_A, PIN2_RESET_B, PIN1_ADC(+), PIN16_PWM(+), PIN15_IRQ/GPIO, PIN14_UART_RX, PIN13_UART_TX, PIN12_TWI_SCL, PIN11_TWI_SDA
X32BUS: PIN3_USART_RX, PIN5_USART_TX, PIN14A_CLK_AUDIO, PIN4_USART_CTS, PIN12_I2S_CK, PIN6_USART_RTS, PIN9_I2C_SDA, PIN7_I2C_SCL, PIN8_STBY/RST_B, PIN11_I2S_DIN, PIN13_I2S_DOUT, PIN10_DMM/I2S_WS, PIN14B_I2S_MCK, PIN2_ANALOG_POT

### Nets
GND: C800.1 D800.3(GND) D800.4(GND) D800.5(GND) D800.9(GND) J800.5(GND) J801.8 J802.8 J803.1 J803.2 J803.15 J803.16 J804.11 J804.12 R800.1 R802.1
VCC_P5V0: J802.7 J803.20
VCC_TARGET_P3V3: J801.7 J803.18
PA02_ADC0: J801.1 J804.2 ; port mikroBUS.PIN1_ADC(+), port X32BUS.PIN2_ANALOG_POT
PA04_S0_SPI_MISO: J801.5 J803.13 ; port mikroBUS.PIN5_SPI_MISO, port X32BUS.PIN13_I2S_DOUT
PA05_S0_SPI_SS: J801.3 J803.10 ; port mikroBUS.PIN3_SPI_SS_A, port X32BUS.PIN10_DMM/I2S_WS
PA08_S2_UART_TX: J802.4 J803.5 ; port mikroBUS.PIN13_UART_TX, port X32BUS.PIN5_USART_TX
PA09_S2_UART_RX: J802.3 J803.3 ; port mikroBUS.PIN14_UART_RX, port X32BUS.PIN3_USART_RX
PA10_GPIO1_S2_USART_RTS: J803.6 ; port X32BUS.PIN6_USART_RTS
PA11_GPIO2_S2_USART_CTS: J803.4 ; port X32BUS.PIN4_USART_CTS
PA14_S0_SPI_MOSI: J801.6 J803.11 ; port mikroBUS.PIN6_SPI_MOSI, port X32BUS.PIN11_I2S_DIN
PA15_S0_SPI_SCK: J801.4 J803.12 ; port mikroBUS.PIN4_SPI_SCK, port X32BUS.PIN12_I2S_CK
PA16_S1_I2C_SDA: J802.6 J803.9 ; port mikroBUS.PIN11_TWI_SDA, port X32BUS.PIN9_I2C_SDA
PA17_S1_I2C_SCL: J802.5 J803.7 ; port mikroBUS.PIN12_TWI_SCL, port X32BUS.PIN7_I2C_SCL
PA18_PWM_TC2_0: J802.1 ; port mikroBUS.PIN16_PWM(+)
PA22_GPIO_IRQ_1: J802.2 R803.1 ; port mikroBUS.PIN15_IRQ/GPIO, port X32BUS.PIN14A_CLK_AUDIO
PA23_GPIO_SS: J801.2 ; port mikroBUS.PIN2_RESET_B
TARGET_MCU_RESET: J803.8 ; port X32BUS.PIN8_STBY/RST_B
TARGET_USB_N: D800.2(DIFF2_EXT) J800.2(D-)
TARGET_USB_P: D800.1(DIFF1_EXT) J800.3(D+)
TARGET_USB_SHIELD: C800.2 J800.6(SHIELD1) J800.7(SHIELD2) J800.8(SHIELD3) J800.9(SHIELD4) R800.2
NetD800_6: D800.6(VBUS) J800.1(VBUS) R801.2
NetJ803_14: J803.14 R803.2 R804.2
NetR801_1: R801.1 R802.2
NetR804_1: R804.1 ; port X32BUS.PIN14B_I2S_MCK

Not connected (* = marked no-connect by the designer): D800 7(DIFF2_INT)* 8(DIFF1_INT)*; J800 4(ID)*; J803 17* 19*; J804 1* 3* 4* 5* 6* 7* 8* 9* 10*

### Layout directives
differential pair; rule Assembly Testpoint Usage [Testpoint - Not Allowed    Multiple - Not Allowed]: TARGET_USB_N, TARGET_USB_P

### Notes on the sheet
- mikroBUS
- TM
- Header (Female)
- (near J801) ADC(+)
- (near J801) RESET
- (near J801) AN
- (near J801) RST
- (near J802) PWM
- (near J802) INT
- (near J802) PWM(+)
- (near J802) IRQ/GPIO
- (near J804) ANALOG_POT
- (near J801) SPI_SS_A
- (near J801) SPI_MISO
- (near J801) SPI_MOSI
- (near J801) SPI_SCK
- (near J801) CS
- (near J801) SCK
- (near J801) MISO
- (near J801) MOSI
- (near J801) +3.3V
- (near J802) RX
- (near J802) TX
- (near J802) SCL
- (near J802) SDA
- (near J802) +5V
- (near J802) TWI_SDA
- (near J802) UART_RX
- (near J802) TWI_SCL
- (near J802) UART_TX
- CLK_AUDIO
- I2S_MCK
- (near J801) GND
- (near J802) GND
- USART_RX
- USART_TX
- (near J803) I2C_SDA
- (near J803) I2C_SCL
- (near J803) I2S_DIN
- (near J803) USART_CTS
- (near J803) USART_RTS
- (near J803) STBY/RST_B
- (near J803) DMM/I2S_WS
- (near J803) I2S_CK
- (near J803) I2S_DOUT
- Divider can be used to check
  if power is available on
  the target USB.
  Vmax ˜ 3.20V
  Vmin ˜ 2.69V
- Drawn By:
- Engineer:
- PartNumber:
- Project Title
- Sheet Title
- Size
- B
- Revision:
- Sch #:
- Date:
- Sheet
- Designed with
- Altium.com <http://go.altium.com/MicrochipLandingPage_Evaluation.html>
- File:

### Library data of the parts
?#4 = Title Block B
C800 = A01-0046: Ceramic capacitor, SMD 0402, X7R, 25V, +/-10% (de35287); PartGroup: Capacitors,Ceramic,SMD 0402; Manufacturer: PHYCOMP; MPN: 2238 587 15632; TemperatureRange: -55 - +125 deg C; ComponentStatus: 'Active (verified)'; Status: Active; Verified by: Lars Helge Mo; Verified date: 2005-12-15; AN: A01-0046; Tolerance: 25V, +/-10%; Height: 0.550000011920929; FootprintStatus: 'Active (Verified)'
D800 = A04-0195: EMI2121, SZEMI2121 Single Pair Common Mode Filter with ESD Protection; PartGroup: Diodes,Transient suppression; Manufacturer: ON Semiconductor; TemperatureRange: âˆ’40 to +85 Â°C; ComponentStatus: 'Active (verified)'; AN: A04-0195; Height: 0.800000011920929; MPN: EMI2121MTTAG; FootprintStatus: 'Active (Verified)'
J800 = A08-2885: micro B USB 2.0 Receptacle Connector 5 Position Surface Mount, Right Angle; Through Hole; PartGroup: Mechanical devices,Connectors,USB; Manufacturer: Amphenol; Value: CONN USB MICRO B RECPT SMT R/A; ComponentStatus: 'Active (verified)'; Verified date: 2006-05-18; Verified by: Eirik Rasmussen; Status: Active; AN: A08-2885; Height: 2.40000009536743; FootprintStatus: 'Active (Verified)'
J801 J802 = A08-2147: PINREX, 2.54mm 1x8 Female Header Straight, THM, H=8.5mm, Gold Flash, Black Insulator; PartGroup: Mechanical devices,Connectors,Pin header receptacle; Manufacturer: PINREX TECHNOLOGY CORP.; Value: 610-91-08GB00; TemperatureRange: -40Â° to +105Â° C; ComponentStatus: 'Active (verified)'; Status: New; AN: A08-2147; Height: 8.5; MPN: 610-91-08GB00; FootprintStatus: 'Active (Verified)'
J803 = A08-1801: 2x10 pin header, 2.54mm pitch, Pin-in-Paste THM, 1mm hole; PartGroup: Mechanical devices,Connectors,Pin headers; Manufacturer: SAMTEC; ComponentStatus: 'Active (verified)'; Status: Active; Verified by: Lars Helge Mo; Verified date: 2005-12-19; AN: A08-1801; Height: 6.09999990463257; MPN: HMTSW-110-23-F-D-237; FootprintStatus: 'Active (Verified)'
J804 = A08-2871: 2x6 pin header, 2.54mm pitch, Pin-in-Paste, 1mm hole; PartGroup: Mechanical devices,Connectors,Pin headers; Manufacturer: SAMTEC; ComponentStatus: 'Active (verified)'; Status: New; AN: A08-2871; Height: 8.5600004196167; MPN: HMTSW-106-23-F-D-237; FootprintStatus: 'Active (Verified)'
R800 = A02-0846: Thick film resistror, SMD 0402, 1/16W, 1%; PartGroup: Resistors,SMD,0402 1%; Manufacturer: YAGEO CORP; MPN: RC0402FR-071ML; TemperatureRange: -55 to +155 deg C; ComponentStatus: 'Active (verified)'; Status: Active; Verified by: Lars Helge Mo; Verified date: 2005-12-19; AN: A02-0846; Tolerance: 1%; Height: 0.349999994039536; FootprintStatus: 'Active (Verified)'
R801 = A02-0247: Thick film resistor, SMD 0402, 1/16W, 1%; PartGroup: Resistors,SMD,0402 1%; Manufacturer: ASJ; MPN: CR10-3002-FK; TemperatureRange: -55ï¿½ to +155ï¿½C; ComponentStatus: 'Active (verified)'; Status: Active; Verified by: Lars Helge Mo; Verified date: 2005-12-19; AN: A02-0247; Tolerance: 1 %; Height: 0.349999994039536; FootprintStatus: 'Active (Verified)'
R802 = A02-0252: as R608 on sheet SHT_7_I_Calibration_07349-R5_L10; Status: Active; Verified by: Lars Helge Mo; Verified date: 2005-12-19; AN: A02-0252; Tolerance: 1 %; Height: 0.349999994039536; FootprintStatus: 'Active (Verified)'
R803 R804 = A02-0163: as R505 on sheet SHT_6_I_Measure_07349-R5_L10; Status: Active; Verified by: Lars Helge Mo; Verified date: 2005-12-19; AN: A02-0163; Height: 0.349999994039536; FootprintStatus: 'Active (Verified)'

## Sheet SHT_8_Ext_Headers_07349-R5_L10.SchDoc
size B; CompanyName: Microchip Technology Inc.; Organization: Microchip Technology; Address1: 2355 West Chandler Blvd.; Address2: Chandler, AZ  85224; Address4: USA; SheetNumber: 8; SheetTotal: 9; SheetTitle: Extension Connectors; Time: Time
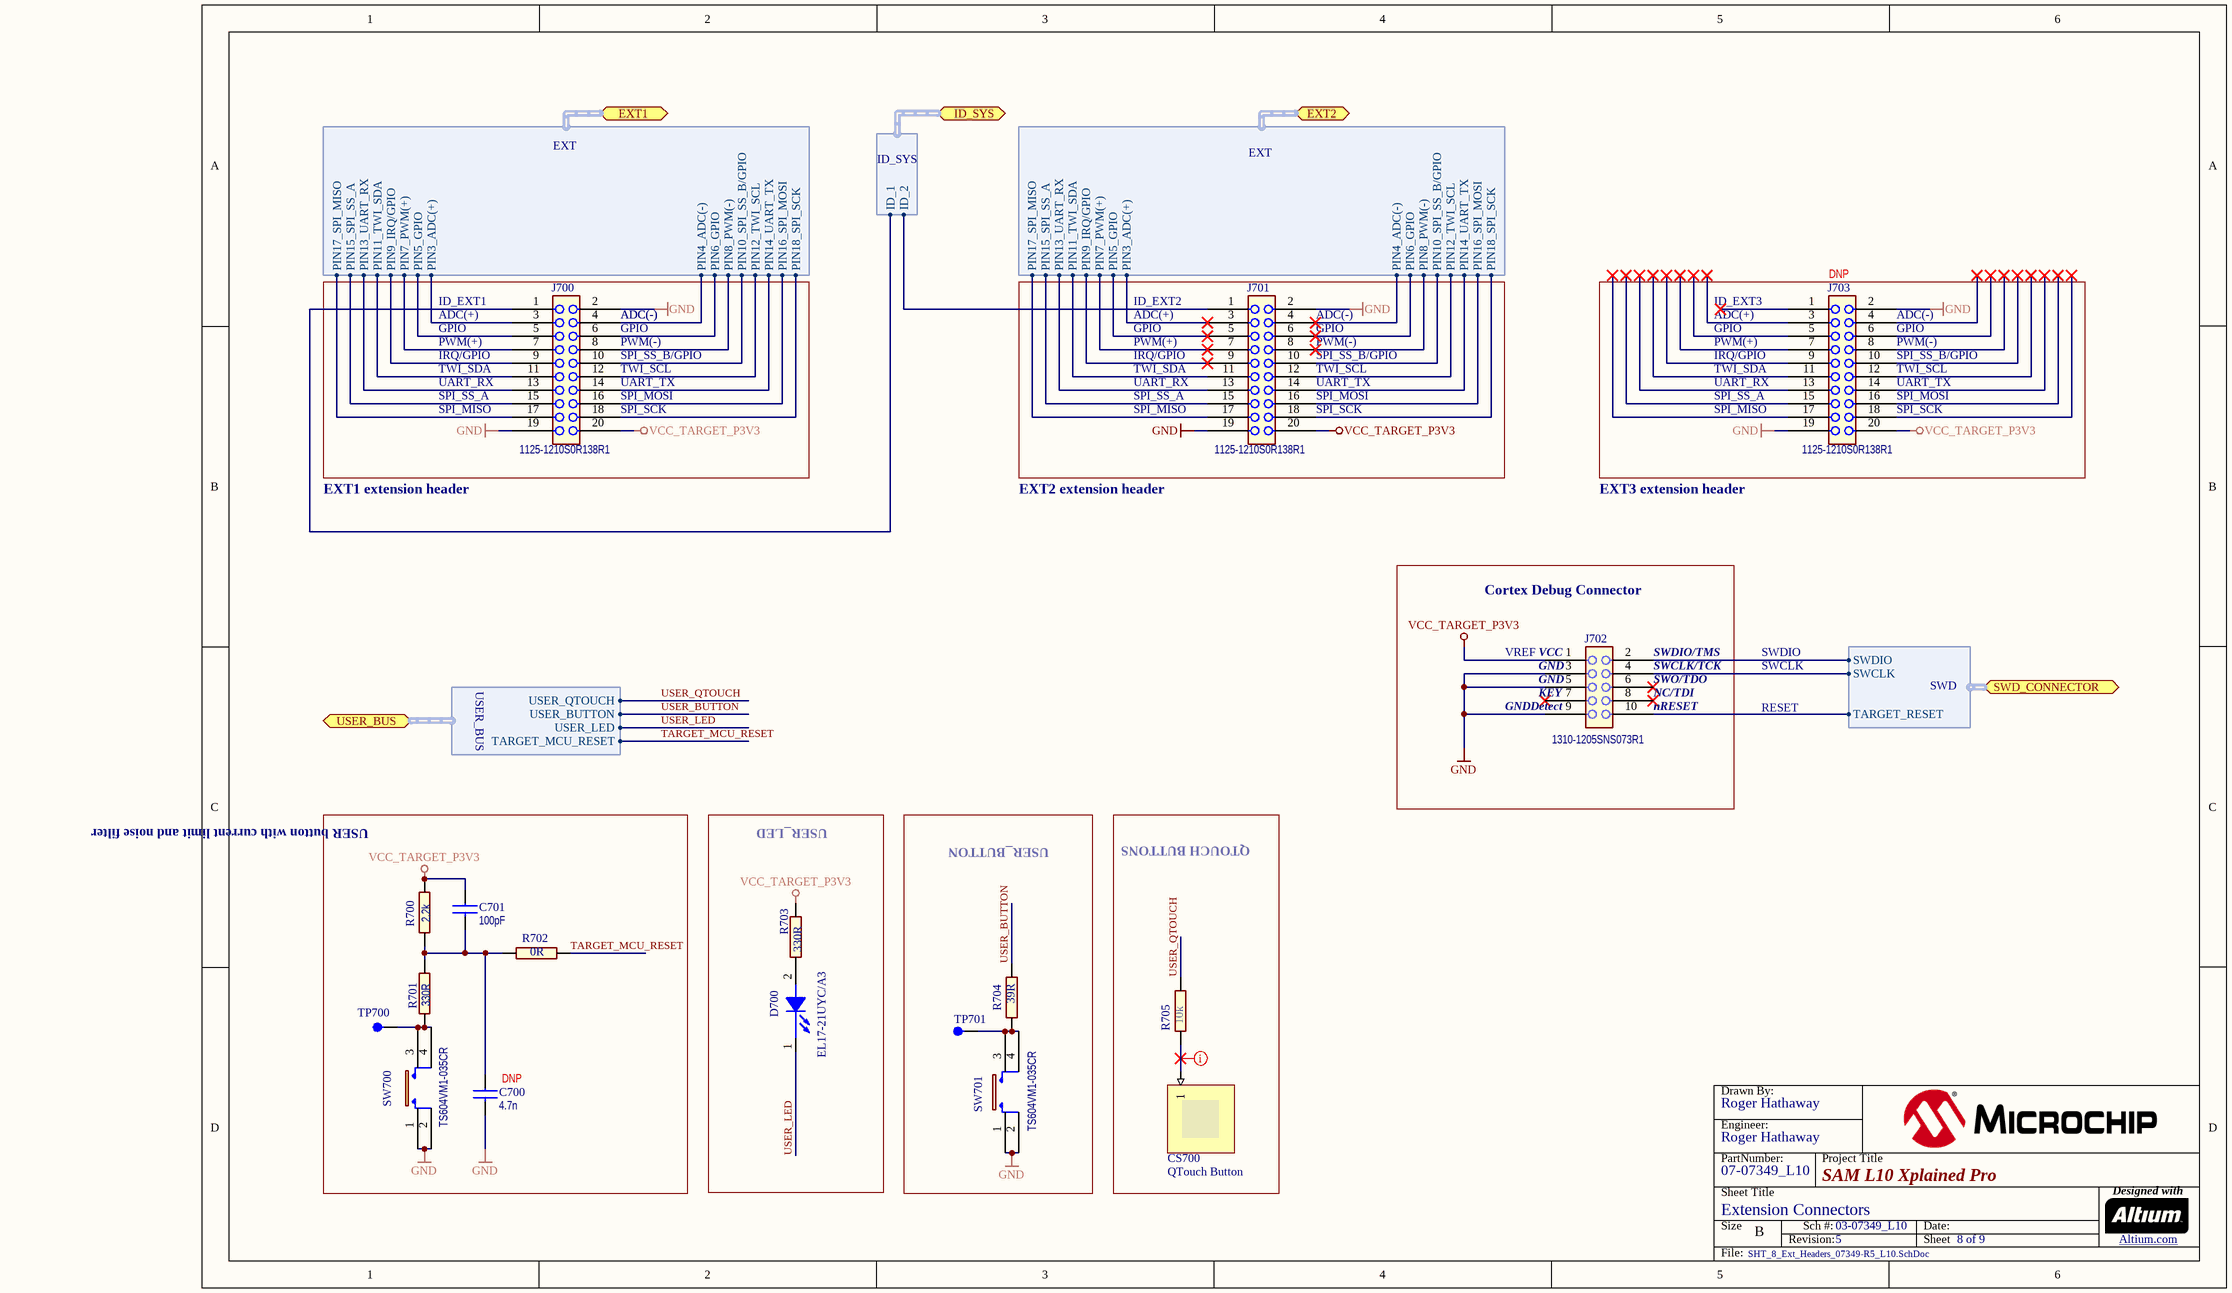
[diagram p4: SHT_8_Ext_Headers_07349-R5_L10.SchDoc]

### Parts
(Parts that share a designator on the sheet are numbered #1, #2 ... from top to bottom, then left to right.)
?#5  (no value)  (graphical)
C700  value 4.7n  Placement: DNP  [AP1-00053]
C701  value 100pF  [AP1-00001]  (hidden comment: CAP-NONPOL)
CS700  QTouch Button  (no BOM)
D700  value EL17-21UYC/A3  [AP4-00013]
J700  value 1125-1210S0R138R1  [AP8-01078]  (hidden comment: HEADER 2x10)
J701  value 1125-1210S0R138R1  [AP8-01078]  (hidden comment: HEADER 2x10)
J702  MPN: 1310-1205SNS073R1  [AP8-01092]  (hidden comment: HEADER 2x5)
J703  value 1125-1210S0R138R1  Placement: DNP  [AP8-01078]  (hidden comment: HEADER 2x10)
R700  value 2.2k  [AP2-00000]
R701  value 330R  [AP2-00000]
R702  value 0R  [AP2-00000]
R703  value 330R  [AP2-00011]
R704  value 39R  [AP2-00011]
R705  value 10k  [AP2-00011]
SW700  value TS604VM1-035CR  [AP8-00137]  (hidden comment: Rating: DC 12V 50mA / Max 0.1 ohm contact resistance)
SW701  value TS604VM1-035CR  [AP8-00137]  (hidden comment: Rating: DC 12V 50mA / Max 0.1 ohm contact resistance)
TP700  (no value)  [AP8-00010]  (no BOM)
TP701  (no value)  [AP8-00010]  (no BOM)

### Blocks framed on the sheet
Cortex Debug Connector: J702
USER button with current limit and noise filter: C700 C701 R700-R702 SW700 TP700
USER_LED: D700 R703
USER_BUTTON: R704 SW701 TP701
QTOUCH BUTTONS: CS700 R705

### Ports
EXT1 (harness EXT), EXT2 (harness EXT), ID_SYS (harness ID_SYS), SWD_CONNECTOR (harness SWD), USER_BUS (harness USER_BUS)

### Harnesses
ID_SYS: ID_1, ID_2
EXT: PIN3_ADC(+), PIN4_ADC(-), PIN5_GPIO, PIN6_GPIO, PIN7_PWM(+), PIN8_PWM(-), PIN9_IRQ/GPIO, PIN10_SPI_SS_B/GPIO, PIN11_TWI_SDA, PIN12_TWI_SCL, PIN13_UART_RX, PIN14_UART_TX, PIN15_SPI_SS_A, PIN16_SPI_MOSI, PIN17_SPI_MISO, PIN18_SPI_SCK
SWD: SWCLK, SWDIO, TARGET_RESET
USER_BUS: USER_QTOUCH, USER_BUTTON, USER_LED, TARGET_MCU_RESET

### Nets
GND: C700.2 J700.2 J700.19 J701.2 J701.19 J702.3 J702.5 J702.9 J703.2 J703.19 SW700.1 SW700.2 SW701.1 SW701.2
VCC_TARGET_P3V3: C701.1 J700.20 J701.20 J702.1 J703.20 R700.2 R703.2
PA02_ADC0: J700.3 ; port EXT1.PIN3_ADC(+)
PA03_ADC1_VREF: J700.4 ; port EXT1.PIN4_ADC(-)
PA04_S0_SPI_MISO: J700.17 J701.17 ; port EXT1.PIN17_SPI_MISO, port EXT2.PIN17_SPI_MISO
PA05_S0_SPI_SS: J700.15 ; port EXT1.PIN15_SPI_SS_A
PA08_S2_UART_TX: J700.14 ; port EXT1.PIN14_UART_TX
PA09_S2_UART_RX: J700.13 ; port EXT1.PIN13_UART_RX
PA10_GPIO1_S2_USART_RTS: J700.5 ; port EXT1.PIN5_GPIO
PA11_GPIO2_S2_USART_CTS: J700.6 ; port EXT1.PIN6_GPIO
PA14_S0_SPI_MOSI: J700.16 J701.16 ; port EXT1.PIN16_SPI_MOSI, port EXT2.PIN16_SPI_MOSI
PA15_S0_SPI_SCK: J700.18 J701.18 ; port EXT1.PIN18_SPI_SCK, port EXT2.PIN18_SPI_SCK
PA16_S1_I2C_SDA: J700.11 J701.11 ; port EXT1.PIN11_TWI_SDA, port EXT2.PIN11_TWI_SDA
PA17_S1_I2C_SCL: J700.12 J701.12 ; port EXT1.PIN12_TWI_SCL, port EXT2.PIN12_TWI_SCL
PA18_PWM_TC2_0: J700.7 ; port EXT1.PIN7_PWM(+)
PA19_PWM_TC2_1: J700.8 ; port EXT1.PIN8_PWM(-)
PA22_GPIO_IRQ_1: J700.9 ; port EXT1.PIN9_IRQ/GPIO
PA23_GPIO_SS: J700.10 ; port EXT1.PIN10_SPI_SS_B/GPIO
PA24_UART_TX: J701.14 ; port EXT2.PIN14_UART_TX
PA25_UART_RX: J701.13 ; port EXT2.PIN13_UART_RX
SWCLK: J702.4 ; port SWD_CONNECTOR.SWCLK
SWDIO: J702.2 ; port SWD_CONNECTOR.SWDIO
TARGET_MCU_RESET: J702.10 R702.1 ; port SWD_CONNECTOR.TARGET_RESET, port USER_BUS.TARGET_MCU_RESET
USER_BUTTON: J701.10 R704.2 ; port EXT2.PIN10_SPI_SS_B/GPIO, port USER_BUS.USER_BUTTON  [project net PA27_GPIO_SS]
USER_LED: D700.1(CATHODE) ; port USER_BUS.USER_LED  [project net PA07_LED_PWM_TC0]
USER_QTOUCH: J701.15 R705.2 ; port EXT2.PIN15_SPI_SS_A, port USER_BUS.USER_QTOUCH  [project net PA06_SPI_SS]
NetC700_1: C700.1 C701.2 R700.1 R701.2 R702.2
NetCS700_1: CS700.1 R705.1
NetD700_2: D700.2(ANODE) R703.1
NetJ700_1: J700.1 ; port ID_SYS.ID_1
NetJ701_1: J701.1 ; port ID_SYS.ID_2
NetJ701_3: J701.3 ; port EXT2.PIN3_ADC(+)
NetJ701_4: J701.4 ; port EXT2.PIN4_ADC(-)
NetJ701_5: J701.5 ; port EXT2.PIN5_GPIO
NetJ701_6: J701.6 ; port EXT2.PIN6_GPIO
NetJ701_7: J701.7 ; port EXT2.PIN7_PWM(+)
NetJ701_8: J701.8 ; port EXT2.PIN8_PWM(-)
NetJ701_9: J701.9 ; port EXT2.PIN9_IRQ/GPIO
NetR701_1: R701.1 SW700.3 SW700.4 TP700.1
NetR704_1: R704.1 SW701.3 SW701.4 TP701.1

Not connected (* = marked no-connect by the designer): J702 6* 7* 8*; J703 1* 3* 4* 5* 6* 7* 8* 9* 10* 11* 12* 13* 14* 15* 16* 17* 18*

### Layout directives
rule Assembly Testpoint Usage [Testpoint - Not Allowed    Multiple - Not Allowed]: NetCS700_1

### Notes on the sheet
- ID_EXT1
- ADC(+)
- GPIO
- PWM(+)
- IRQ/GPIO
- TWI_SDA
- (near J700) ADC(-)
- (near J700) GPIO
- (near J700) PWM(-)
- (near J700) SPI_SS_B/GPIO
- (near J700) TWI_SCL
- ID_EXT2
- (near J701) ADC(-)
- (near J701) GPIO
- (near J701) PWM(-)
- (near J701) SPI_SS_B/GPIO
- (near J701) TWI_SCL
- ID_EXT3
- (near J703) ADC(-)
- (near J703) GPIO
- (near J703) PWM(-)
- (near J703) SPI_SS_B/GPIO
- (near J703) TWI_SCL
- UART_RX
- SPI_SS_A
- SPI_MISO
- (near J700) UART_TX
- (near J700) SPI_MOSI
- (near J700) SPI_SCK
- (near J701) UART_TX
- (near J701) SPI_MOSI
- (near J701) SPI_SCK
- (near J703) UART_TX
- (near J703) SPI_MOSI
- (near J703) SPI_SCK
- EXT1 extension header
- EXT2 extension header
- EXT3 extension header
- VREF
- (near J702) VCC
- (near J702) GND
- (near J702) KEY
- (near J702) SWDIO/TMS
- (near J702) SWCLK/TCK
- (near J702) SWO/TDO
- (near J702) NC/TDI
- SWDIO
- SWCLK
- RESET
- (near J702) GNDDetect
- (near J702) nRESET
- Drawn By:
- Engineer:
- PartNumber:
- Project Title
- Sheet Title
- Size
- B
- Revision:
- Sch #:
- Date:
- Sheet
- Designed with
- Altium.com <http://go.altium.com/MicrochipLandingPage_Evaluation.html>
- File:

### Library data of the parts
?#5 = Title Block B
C700 = A01-0046: as C800 on sheet SHT_9_X32-mikroBUS_07349-R5_L10; Status: Active; Verified by: Lars Helge Mo; Verified date: 2005-12-15; AN: A01-0046; Tolerance: 25V, +/-10%; Height: 0.550000011920929; FootprintStatus: 'Active (Verified)'
C701 = A01-0629: Ceramic Capacitor, SMD 0402, COG, 50V, +/-5%; PartGroup: Capacitors,Ceramic,SMD 0402; Manufacturer: Murata; MPN: GRM1555C1H101JA01D; Tolerance: Â±5%; TemperatureRange: -55 Â°C to +125 Â°C; ComponentStatus: 'Active (verified)'; Status: Active; Verified by: Lars Helge Mo; Verified date: 2005-12-15; AN: A01-0629; Height: 0.5; FootprintStatus: 'Active (Verified)'
CS700 = QTouchButton: ConfiguratorName: ATMEL_TOUCH; ConfigurationParameters: {}__sensorid[1]{}width[8]{}height[8]{}
D700 = A10-0019: LED, Yellow, Wave length=591nm, SMD 0805, ±70°; PartGroup: Opto,LEDs,SMD; Manufacturer: Everlight; MPN: 17-21UYC/S530-A3/TR8; TemperatureRange: -40 to +85 deg C; ComponentStatus: 'Active (verified)'; Verified date: 2006-02-17; Verified by: Sveinung Helgeland; Status: Active; AN: A10-0019; Height: 1.10000002384186; FootprintStatus: 'Active (Verified)'
J700 J701 J703 = A08-2786: Pin header, 2x10, Right Angle, 2.54mm, THM, Pin In Paste; PartGroup: Mechanical devices,Connectors,Pin headers; Manufacturer: WCON HARDWARE ELECTRONICS CO., LTD; ComponentStatus: 'Active (verified)'; Status: Active; Verified by: Lars Helge Mo; Verified date: 2005-12-19; AN: A08-2786; Height: 5.15000009536743; MPN: 1125-1210S0R138R1; FootprintStatus: 'Active (Verified)'
J702 = A08-2827: 2x5 pin header, 1.27mm pitch, THM; PartGroup: Mechanical devices,Connectors,Pin headers; Manufacturer: WCON HARDWARE ELECTRONICS CO., LTD; Value: PIN HEADER 2x5; ComponentStatus: 'Active (verified)'; Verified date: 2005-12-19; Verified by: Lars Helge Mo; Status: Active; AN: A08-2827; Height: 4; FootprintStatus: 'Active (Verified)'
R700 = A02-0220: Thick film resistor, SMD 0402, 1/16W, 1%; PartGroup: Resistors,SMD,0402 1%; Manufacturer: ASJ; MPN: CR10-2201-FK; TemperatureRange: -55 - +125 deg C; ComponentStatus: 'Active (verified)'; Status: Active; Verified by: Lars Helge Mo; Verified date: 2005-12-19; AN: A02-0220; Tolerance: 1 %; Height: 0.349999994039536; FootprintStatus: 'Active (Verified)'
R701 R703 = A02-0200: Thick film resistor, SMD 0402, 1/16W, 1%; PartGroup: Resistors,SMD,0402 1%; Manufacturer: ASJ; MPN: CR10-3300-FK; TemperatureRange: -55 - +125 deg C; ComponentStatus: 'Active (verified)'; Status: Active; Verified by: Lars Helge Mo; Verified date: 2005-12-19; AN: A02-0200; Tolerance: 1 %; Height: 0.349999994039536; FootprintStatus: 'Active (Verified)'
R702 = A02-0163: as R505 on sheet SHT_6_I_Measure_07349-R5_L10; Status: Active; Verified by: Lars Helge Mo; Verified date: 2005-12-19; AN: A02-0163; Height: 0.349999994039536; FootprintStatus: 'Active (Verified)'
R704 = A02-0178: Thick film resistor, SMD 0402, 1/16W, 1%; PartGroup: Resistors,SMD,0402 1%; Manufacturer: ASJ; MPN: CR10-39R0-FK; TemperatureRange: -55 - +125 deg C; ComponentStatus: 'Active (verified)'; Status: Active; Verified by: Lars Helge Mo; Verified date: 2005-12-19; AN: A02-0178; Tolerance: 1 %; Height: 0.349999994039536; FootprintStatus: 'Active (Verified)'
R705 = A02-0236: Thick film resistor, SMD 0402, 1/16W, 1%; PartGroup: Resistors,SMD,0402 1%; Manufacturer: vishay; MPN: CRCW040210K0FKED; TemperatureRange: -55 - +125 deg C; ComponentStatus: 'Active (verified)'; Status: Active; Verified by: Lars Helge Mo; Verified date: 2005-12-19; AN: A02-0236; Tolerance: 1 %; Height: 0.349999994039536; FootprintStatus: 'Active (Verified)'
SW700 SW701 = A08-2830: SWITCH, SMD, 260gf, 6.4mm X 6.2mm; PartGroup: Mechanical devices,Switches,SMD; Manufacturer: Dailywell Electronics Co.LTD; MPN: TS604VM1-035CR-R; TemperatureRange: -40 - +85 deg C; ComponentStatus: 'Active (verified)'; Status: Active; Verified by: Ketil Skjerve; Verified date: 2006-03-15; AN: A08-2830; Height: 3.5; FootprintStatus: 'Active (Verified)'
TP700 TP701 = A08-0004: Single SMD testpad; PartGroup: Mechanical devices,Connectors,Test points; ComponentStatus: 'Active (verified)'; Status: Active; Verified by: Sveinung Helgeland; Verified date: 2006-02-17; AN: A08-0004; Value: TESTPAD; Height: 0; FootprintStatus: 'Active (Verified)'